# Altium schematic sheet VDD_div.SchDoc
size A4
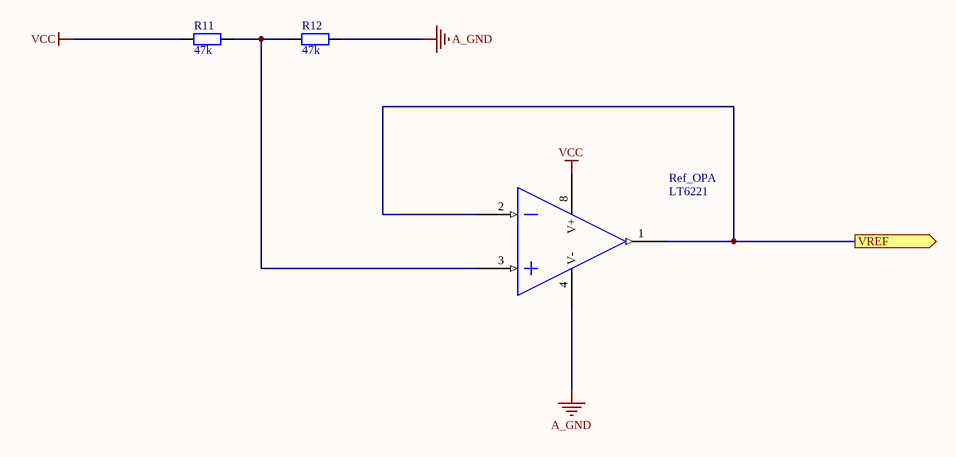
[diagram p0: VDD_div.SchDoc]

## Parts
R11  47k
R12  47k
Ref_OP  LT6221  (part A of 2)

## Ports
VREF (out)

## Nets
A_GND: R12.2 Ref_OP.4(V-)
VCC: R11.1 Ref_OP.8(V+)
VREF: Ref_OP.1(OUT1) Ref_OP.2(IN1(-)) ; port VREF
NetR11_2: R11.2 R12.1 Ref_OP.3(IN1(+))

## Library data of the parts
R11 R12 = Resistor: Value: *